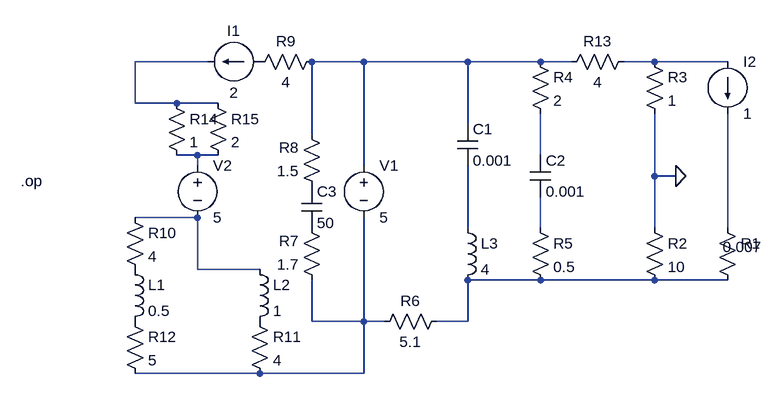
[diagram p0: schematic multiplesourcesRLC.asc]
multiplesourcesRLC.asc, the LTspice schematic file:
Version 4
SHEET 1 1020 680
WIRE 160 96 48 96
WIRE 400 96 320 96
WIRE 560 96 400 96
WIRE 672 96 560 96
WIRE 720 96 672 96
WIRE 848 96 800 96
WIRE 960 96 848 96
WIRE 400 256 400 96
WIRE 48 160 48 96
WIRE 112 160 48 160
WIRE 176 160 112 160
WIRE 560 192 560 96
WIRE 320 208 320 96
WIRE 144 240 112 240
WIRE 176 240 144 240
WIRE 672 240 672 176
WIRE 144 256 144 240
WIRE 848 272 848 176
WIRE 880 272 848 272
WIRE 144 336 48 336
WIRE 560 352 560 256
WIRE 672 352 672 304
WIRE 848 352 848 272
WIRE 960 352 960 176
WIRE 144 416 144 336
WIRE 240 416 144 416
WIRE 672 432 560 432
WIRE 848 432 672 432
WIRE 960 432 848 432
WIRE 320 496 320 432
WIRE 400 496 400 336
WIRE 400 496 320 496
WIRE 432 496 400 496
WIRE 560 496 560 432
WIRE 560 496 512 496
WIRE 240 576 48 576
WIRE 400 576 400 496
WIRE 400 576 240 576
FLAG 880 272 0
SYMBOL voltage 400 240 R0
SYMATTR InstName V1
SYMATTR Value 5
SYMBOL voltage 144 240 R0
SYMATTR InstName V2
SYMATTR Value 5
SYMBOL current 240 96 R90
WINDOW 0 -32 40 VBottom 2
WINDOW 3 32 40 VTop 2
SYMATTR InstName I1
SYMATTR Value 2
SYMBOL current 960 96 R0
SYMATTR InstName I2
SYMATTR Value 1
SYMBOL ind 32 400 R0
SYMATTR InstName L1
SYMATTR Value 0.5
SYMBOL ind 224 400 R0
SYMATTR InstName L2
SYMATTR Value 1
SYMBOL ind 544 336 R0
SYMATTR InstName L3
SYMATTR Value 4
SYMBOL cap 544 192 R0
SYMATTR InstName C1
SYMATTR Value 0.001
SYMBOL cap 656 240 R0
SYMATTR InstName C2
SYMATTR Value 0.001
SYMBOL cap 304 288 R0
SYMATTR InstName C3
SYMATTR Value 50
SYMBOL res 944 336 R0
WINDOW 3 9 45 Left 2
SYMATTR Value 0.007
SYMATTR InstName R1
SYMBOL res 832 336 R0
SYMATTR InstName R2
SYMATTR Value 10
SYMBOL res 832 80 R0
SYMATTR InstName R3
SYMATTR Value 1
SYMBOL res 656 80 R0
SYMATTR InstName R4
SYMATTR Value 2
SYMBOL res 656 336 R0
SYMATTR InstName R5
SYMATTR Value 0.5
SYMBOL res 528 480 R90
WINDOW 0 0 56 VBottom 2
WINDOW 3 32 56 VTop 2
SYMATTR InstName R6
SYMATTR Value 5.1
SYMBOL res 336 448 R180
WINDOW 0 36 76 Left 2
WINDOW 3 36 40 Left 2
SYMATTR InstName R7
SYMATTR Value 1.7
SYMBOL res 336 304 R180
WINDOW 0 36 76 Left 2
WINDOW 3 36 40 Left 2
SYMATTR InstName R8
SYMATTR Value 1.5
SYMBOL res 224 112 R270
WINDOW 0 32 56 VTop 2
WINDOW 3 0 56 VBottom 2
SYMATTR InstName R9
SYMATTR Value 4
SYMBOL res 32 320 R0
SYMATTR InstName R10
SYMATTR Value 4
SYMBOL res 224 480 R0
SYMATTR InstName R11
SYMATTR Value 4
SYMBOL res 32 480 R0
SYMATTR InstName R12
SYMATTR Value 5
SYMBOL res 816 80 R90
WINDOW 0 0 56 VBottom 2
WINDOW 3 32 56 VTop 2
SYMATTR InstName R13
SYMATTR Value 4
SYMBOL res 96 144 R0
SYMATTR InstName R14
SYMATTR Value 1
SYMBOL res 160 144 R0
SYMATTR InstName R15
SYMATTR Value 2
TEXT -128 280 Left 2 !.op

The netlist it stands for:
* multiplesourcesRLC.asc
V1 N002 N011 5
V2 N004 N006 5
I1 P001 N001 2
I2 N003 N009 1
L1 P002 P003 0.5
L2 N006 P004 1
L3 N007 N010 4
C1 N002 N007 0.001
C2 N005 N008 0.001
C3 P005 P006 50
R1 N009 N010 0.007
R2 0 N010 10
R3 N003 0 1
R4 N002 N005 2
R5 N008 N010 0.5
R6 N010 N011 5.1
R7 N011 P006 1.7
R8 P005 N002 1.5
R9 P001 N002 4
R10 N006 P002 4
R11 P004 N011 4
R12 P003 N011 5
R13 N003 N002 4
R14 N001 N004 1
R15 N001 N004 2
.op
.backanno
.end